# Altium schematic sheet IIC_LCD.SchDoc
size A3
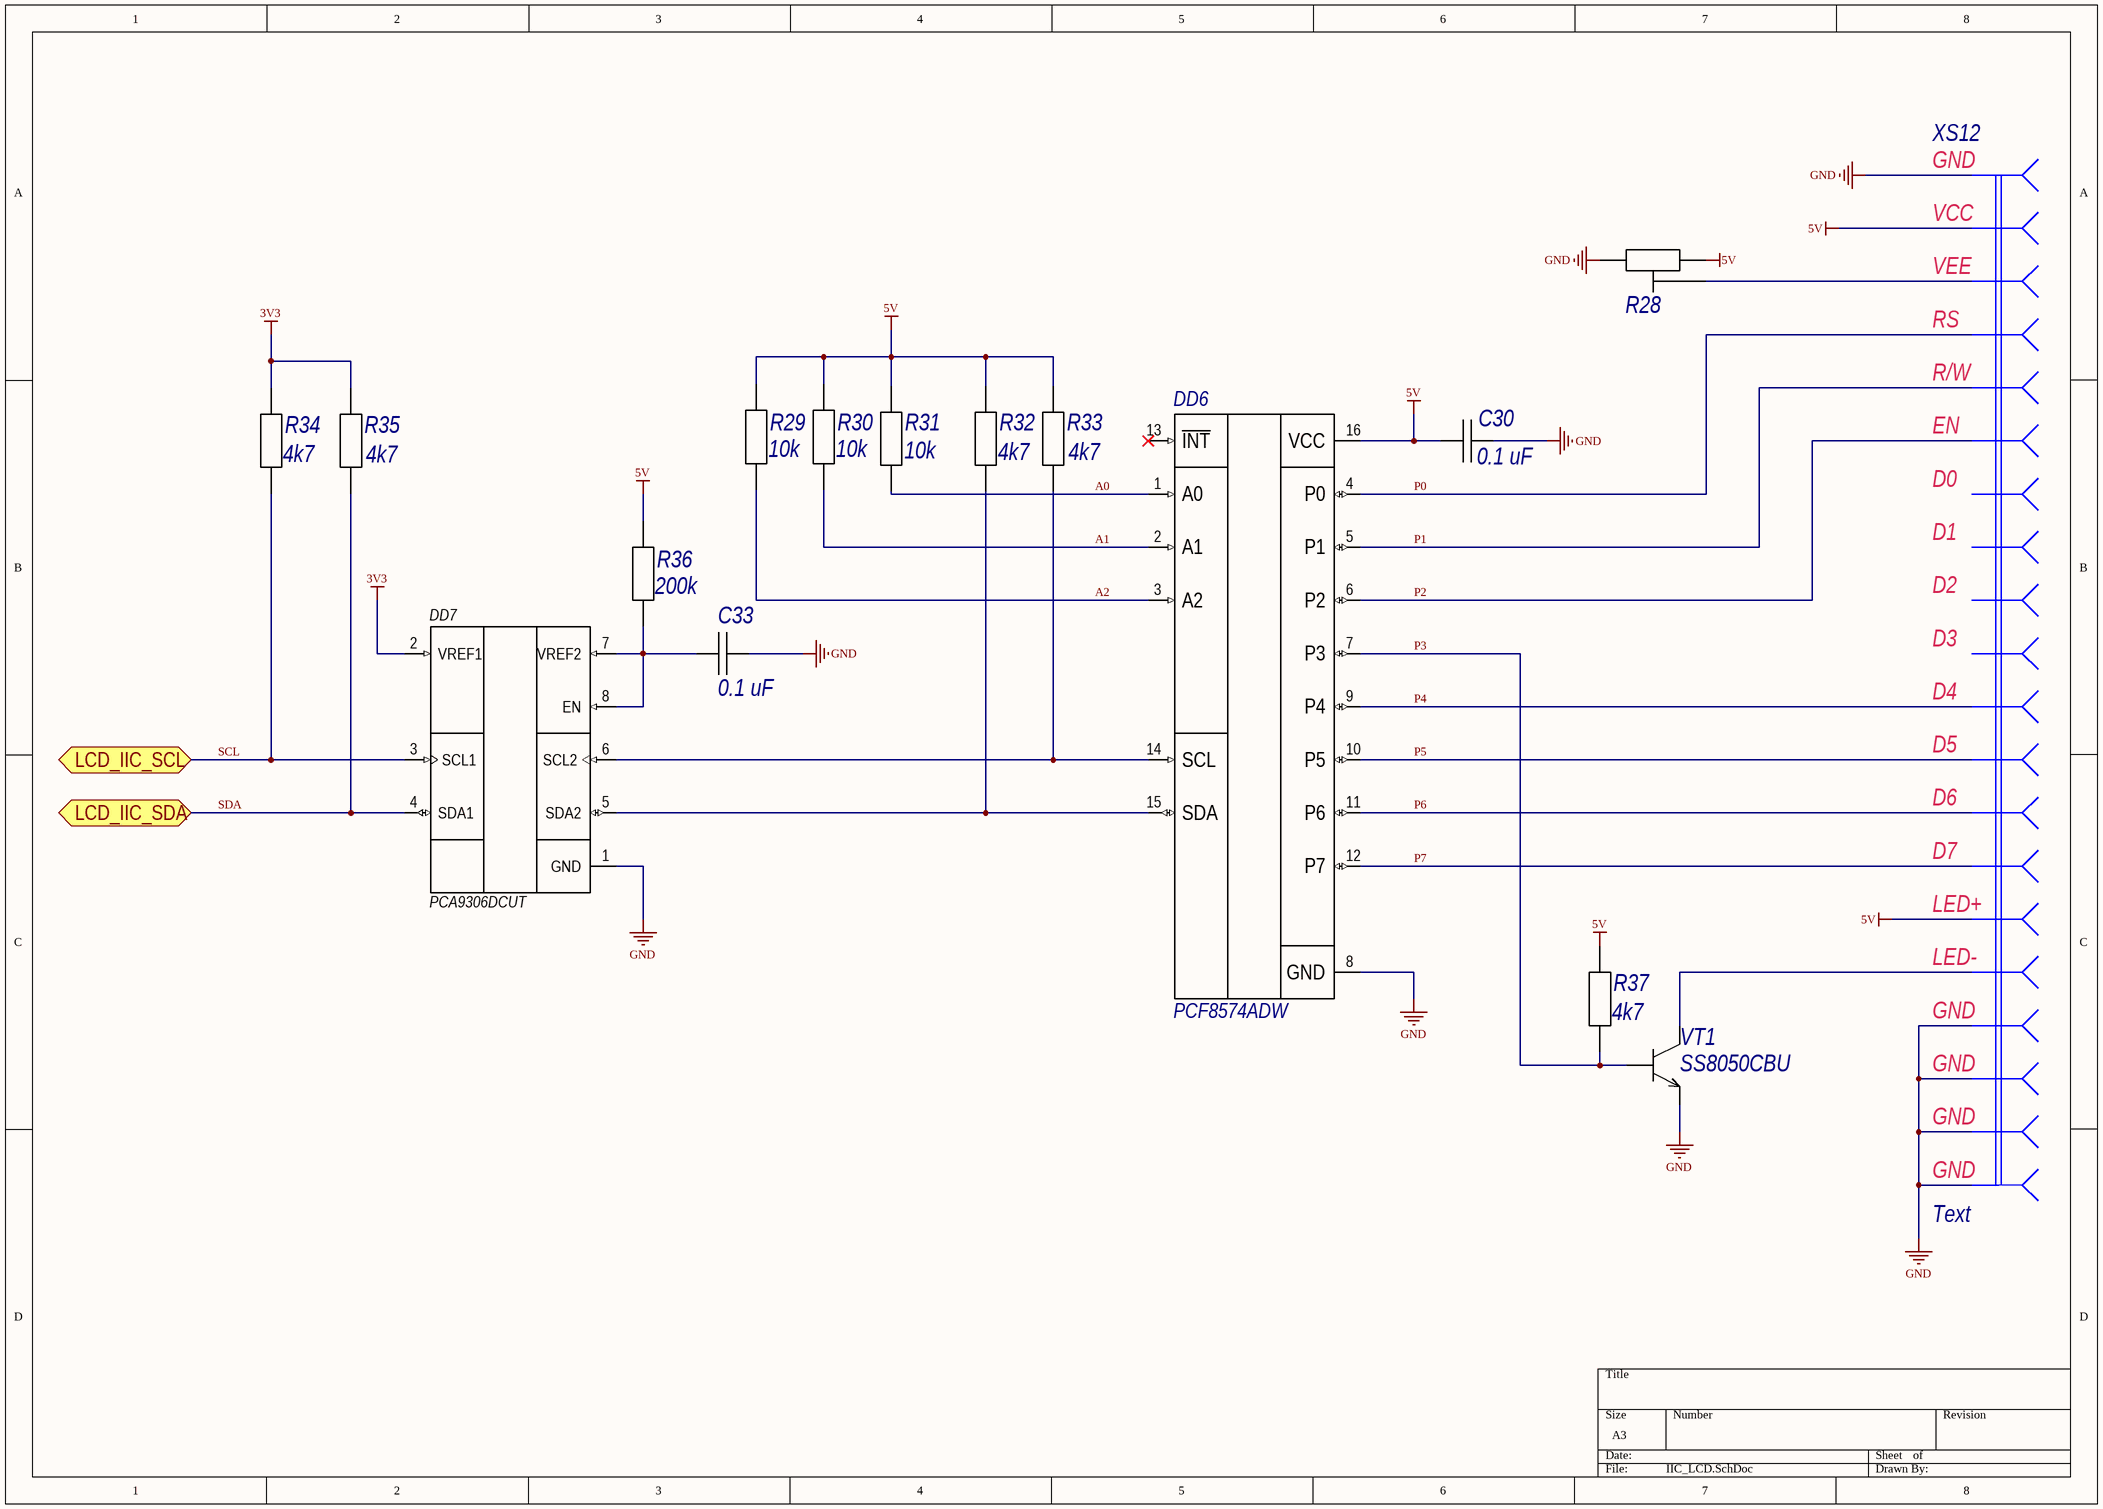
[diagram p0: IIC_LCD.SchDoc]

## Parts
C30  0.1 uF  [C0805C]
C33  0.1 uF  [C0805C]
DD6  PCF8574ADW  [SOIC127P1030X265-16N]
DD7  PCA9306DCUT  [SOP50P310X90-8N]
R28  RES_VAR  [TRIM_3296W-1-254LF]  (value not drawn)
R29  10k  [C0805R]
R30  10k  [C0805R]
R31  10k  [C0805R]
R32  4k7  [C0805R]
R33  4k7  [C0805R]
R34  4k7  [C0805R]
R35  4k7  [C0805R]
R36  200k  [C0805R]
R37  4k7  [C0805R]
VT1  SS8050CBU  [TO-92-A]
XS12  Text  [IDC-20]

## Ports
LCD_IIC_SCL (bidir), LCD_IIC_SDA (bidir)

## Nets
3V3: DD7.2(VREF1) R34.2 R35.2
5V: C30.2 DD6.16(VCC) R28.1 R29.2 R30.2 R31.2 R32.2 R33.2 R36.2 R37.2 XS12.2 XS12.15
GND: C30.1 C33.2 DD6.8(GND) DD7.1(GND) R28.3 VT1.3(Э) XS12.1 XS12.17 XS12.18 XS12.19 XS12.20
A0: DD6.1(A0) R31.1
A1: DD6.2(A1) R30.1
A2: DD6.3(A2) R29.1
P0: DD6.4(P0) XS12.4
P1: DD6.5(P1) XS12.5
P2: DD6.6(P2) XS12.6
P3: DD6.7(P3) R37.1 VT1.1(Б)
P4: DD6.9(P4) XS12.11
P5: DD6.10(P5) XS12.12
P6: DD6.11(P6) XS12.13
P7: DD6.12(P7) XS12.14
SCL: DD7.3(SCL1) R34.1 ; port LCD_IIC_SCL
SDA: DD7.4(SDA1) R35.1 ; port LCD_IIC_SDA
NetC33_1: C33.1 DD7.7(VREF2) DD7.8(EN) R36.1
NetDD6_14: DD6.14(SCL) DD7.6(SCL2) R33.1
NetDD6_15: DD6.15(SDA) DD7.5(SDA2) R32.1
NetR28_2: R28.2 XS12.3
NetVT1_2: VT1.2(К) XS12.16

Not connected (* = marked no-connect by the designer): DD6 13(~{INT})*; XS12 7 8 9 10

## Notes on the sheet
- (in symbol CONNECT_LCD) GND; VCC; VEE; RS; R/W; EN; D0; D1; D2; D3; D4; D5; D6; D7; LED+; LED-

## Library data of the parts
C30 C33 = CAP_0805: Type: Конденсатор; Published: 18.05.2010; Publisher: Andrew Danich
DD6 = PCF8574ADW: Remote 8-Bit I/O Expander for I2C-Bus 16-SOIC -40 to 85; MF: Texas Instruments; Mouser-Purchase-URL: https://snapeda.com/shop?store=Mouser&id=554599; SnapEDA_Link: https://www.snapeda.com/parts/PCF8574ADW/Texas%20Instruments/view-part/554599/?ref=snap; DigiKey-Purchase-URL: https://snapeda.com/shop?store=DigiKey&id=554599; Package: SOIC-16 Texas Instruments; MP: PCF8574ADW; Price: None; Availability: Warning; Texas_Instruments-Purchase-URL: https://snapeda.com/shop?store=Texas+Instruments&id=554599; Value: *
DD7 = PCA9306DCUT: 2-bit bidirectional I2C bus and SMBus voltage-level shifter 8-VSSOP -40 to 85; MF: Texas Instruments; SnapEDA_Link: https://www.snapeda.com/parts/PCA9306DCUT/Texas%20Instruments/view-part/39070/?ref=snap; DigiKey-Purchase-URL: https://snapeda.com/shop?store=DigiKey&id=39070; MP: PCA9306DCUT; Arrow_Electronics-Purchase-URL: https://snapeda.com/shop?store=Arrow+Electronics&id=39070; Availability: Good; Package: VSSOP-8 Texas Instruments; Mouser-Purchase-URL: https://snapeda.com/shop?store=Mouser&id=39070; Price: None; Value: *; Texas_Instruments-Purchase-URL: https://snapeda.com/shop?store=Texas+Instruments&id=39070
R29-R37 = RES_0805: Published: 24.03.2010; Publisher: Andrew Danich; Type: Резистор
VT1 = SS8050CBU: Type: Транзистор; Published: 07.05.2013; Publisher: Andrew Danich
XS12 = CONNECT_LCD: Value: Connector; Published: 07.03.2013; Publisher: Andrew Danich; Type: Розетка
R28 = RES_VAR: Publisher: Andrew Danich; Type: Подстроечный резистор; Published: 27.07.2015